# Altium schematic sheet D1.SchDoc
size D; SheetNumber: 0; SheetTotal: 0
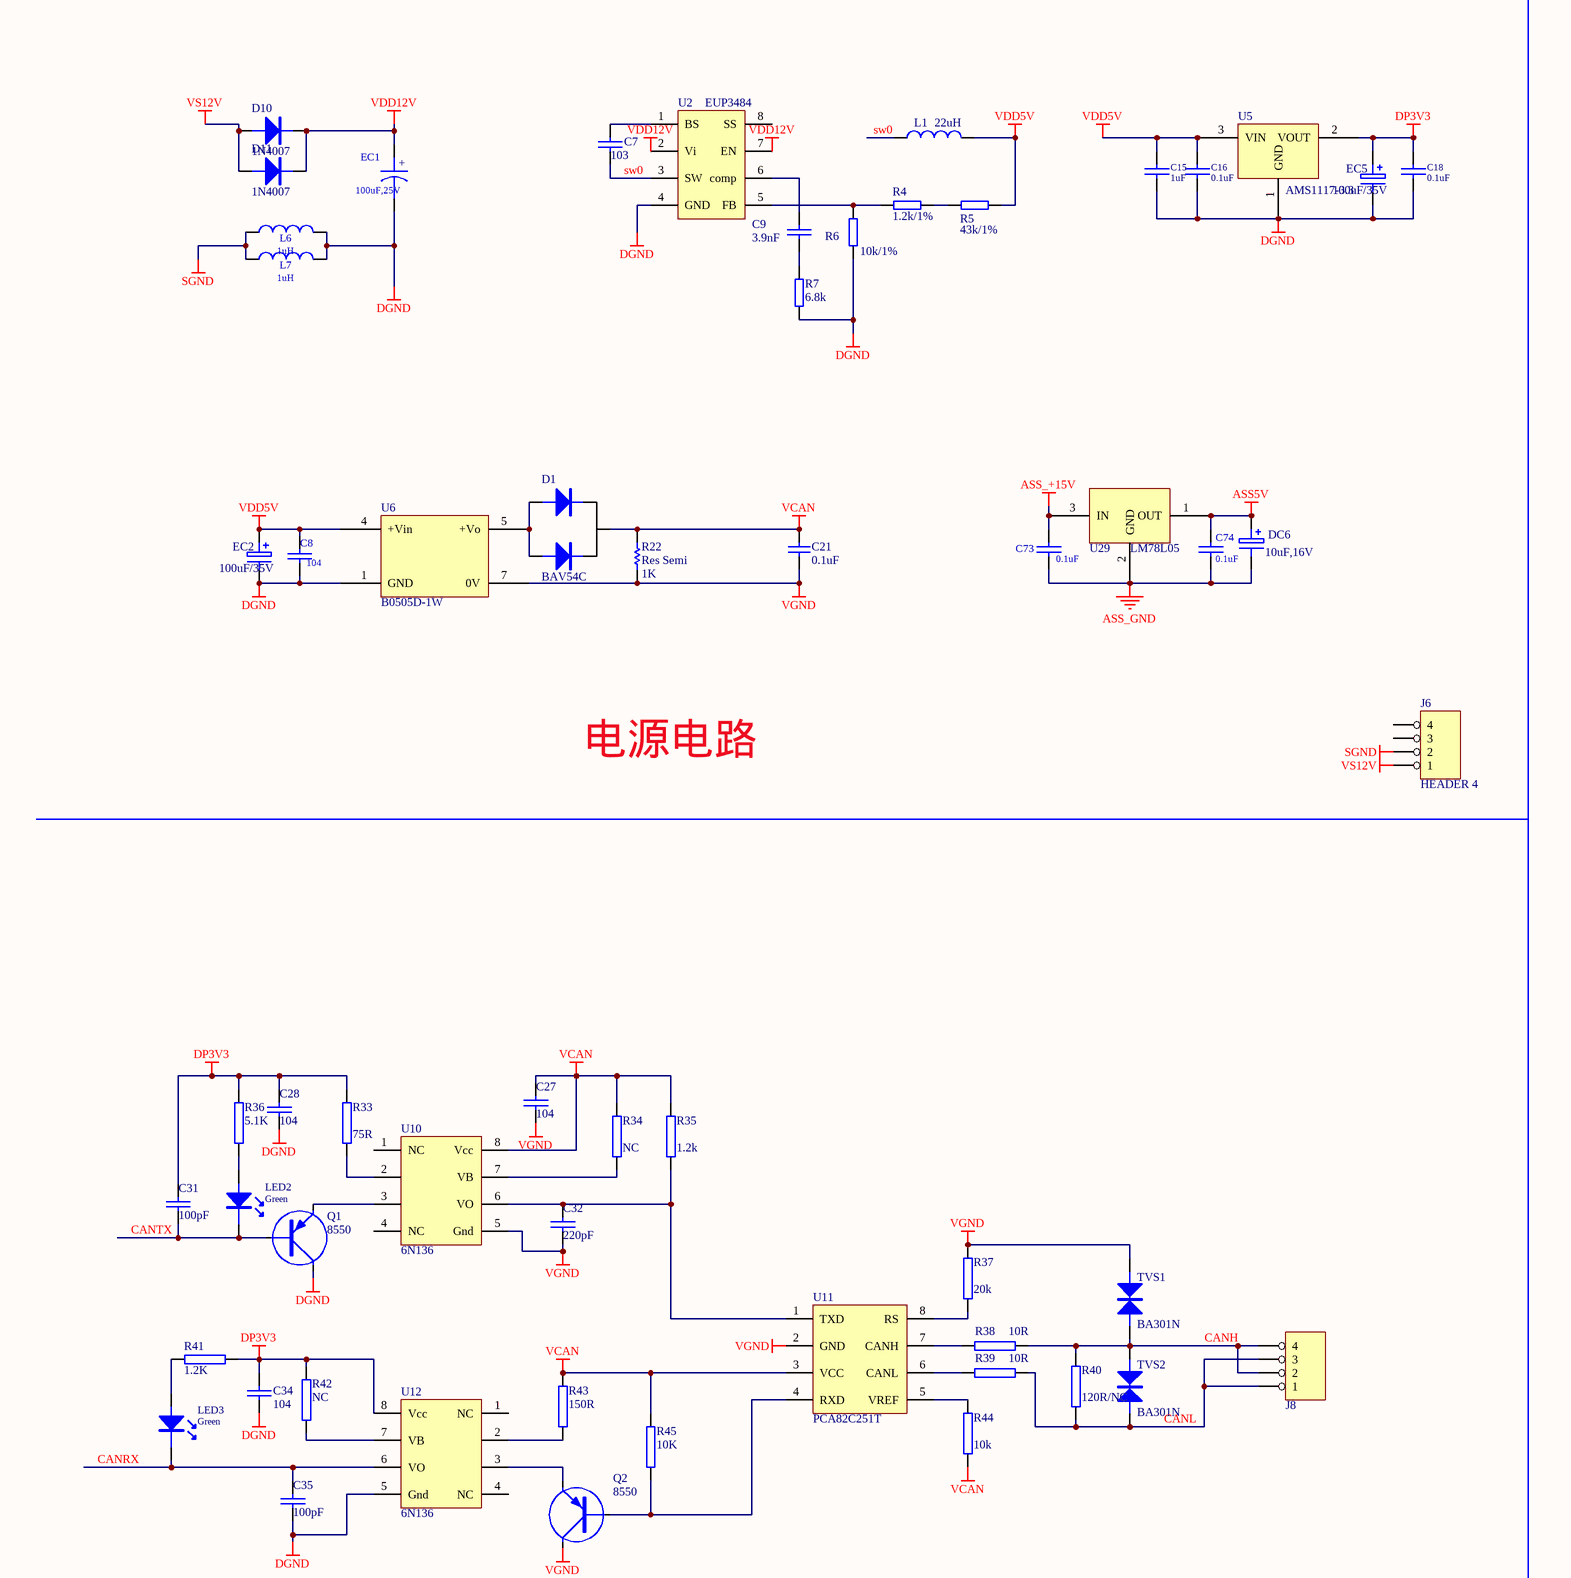
[diagram p0: D1.SchDoc, top left]
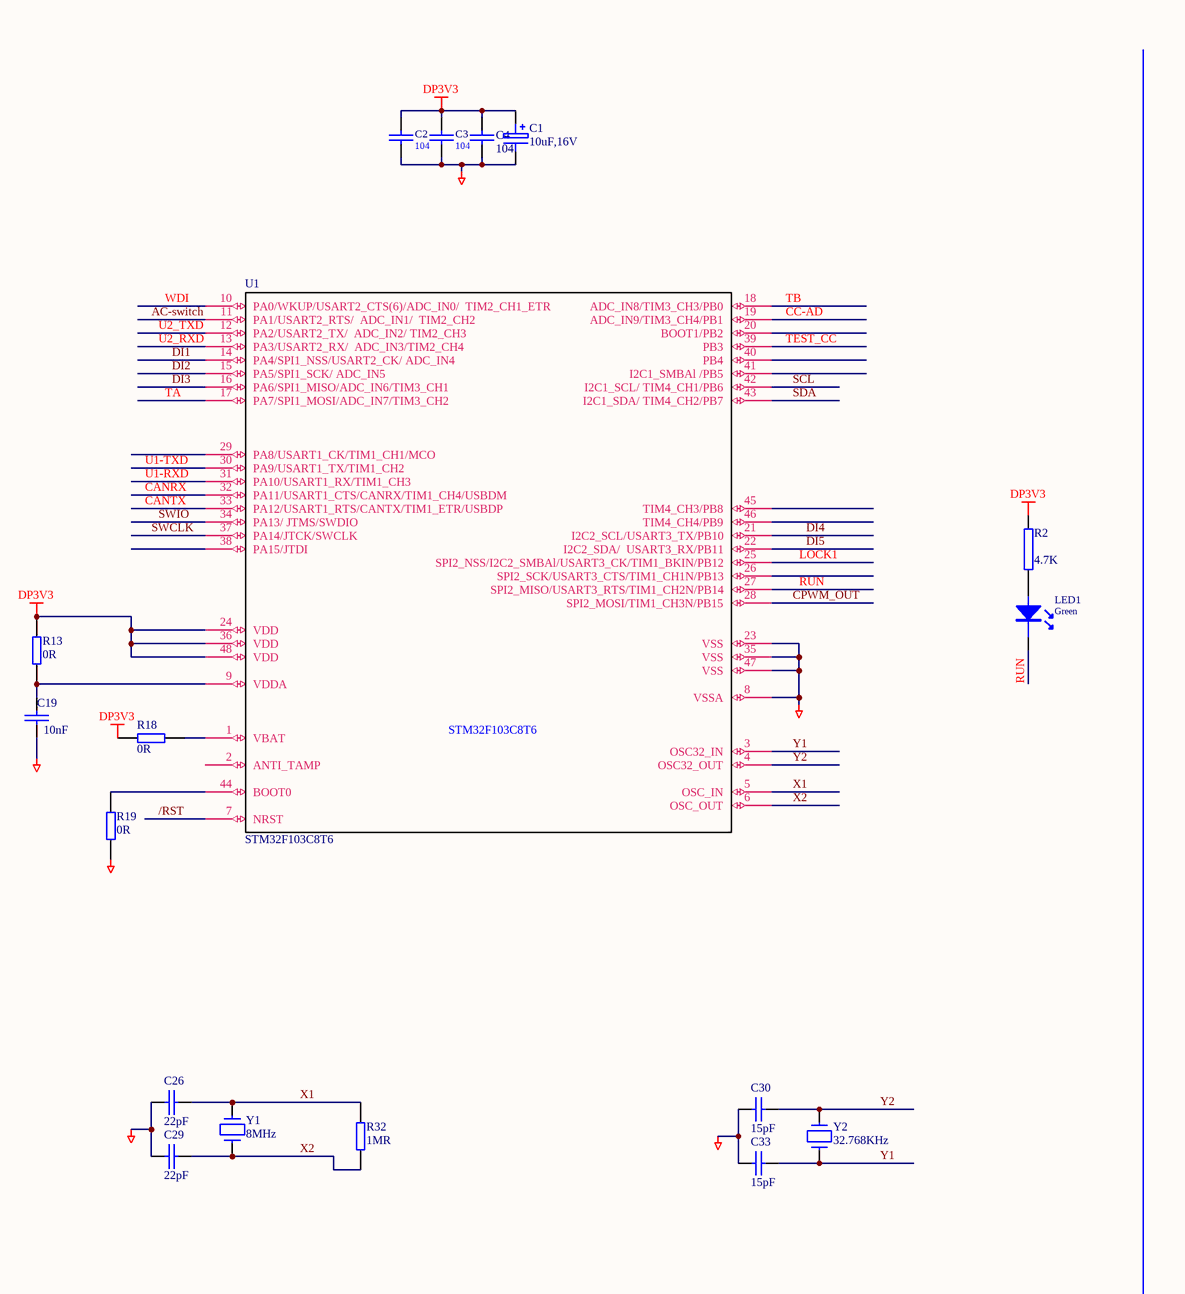
[diagram p1: D1.SchDoc, top middle]
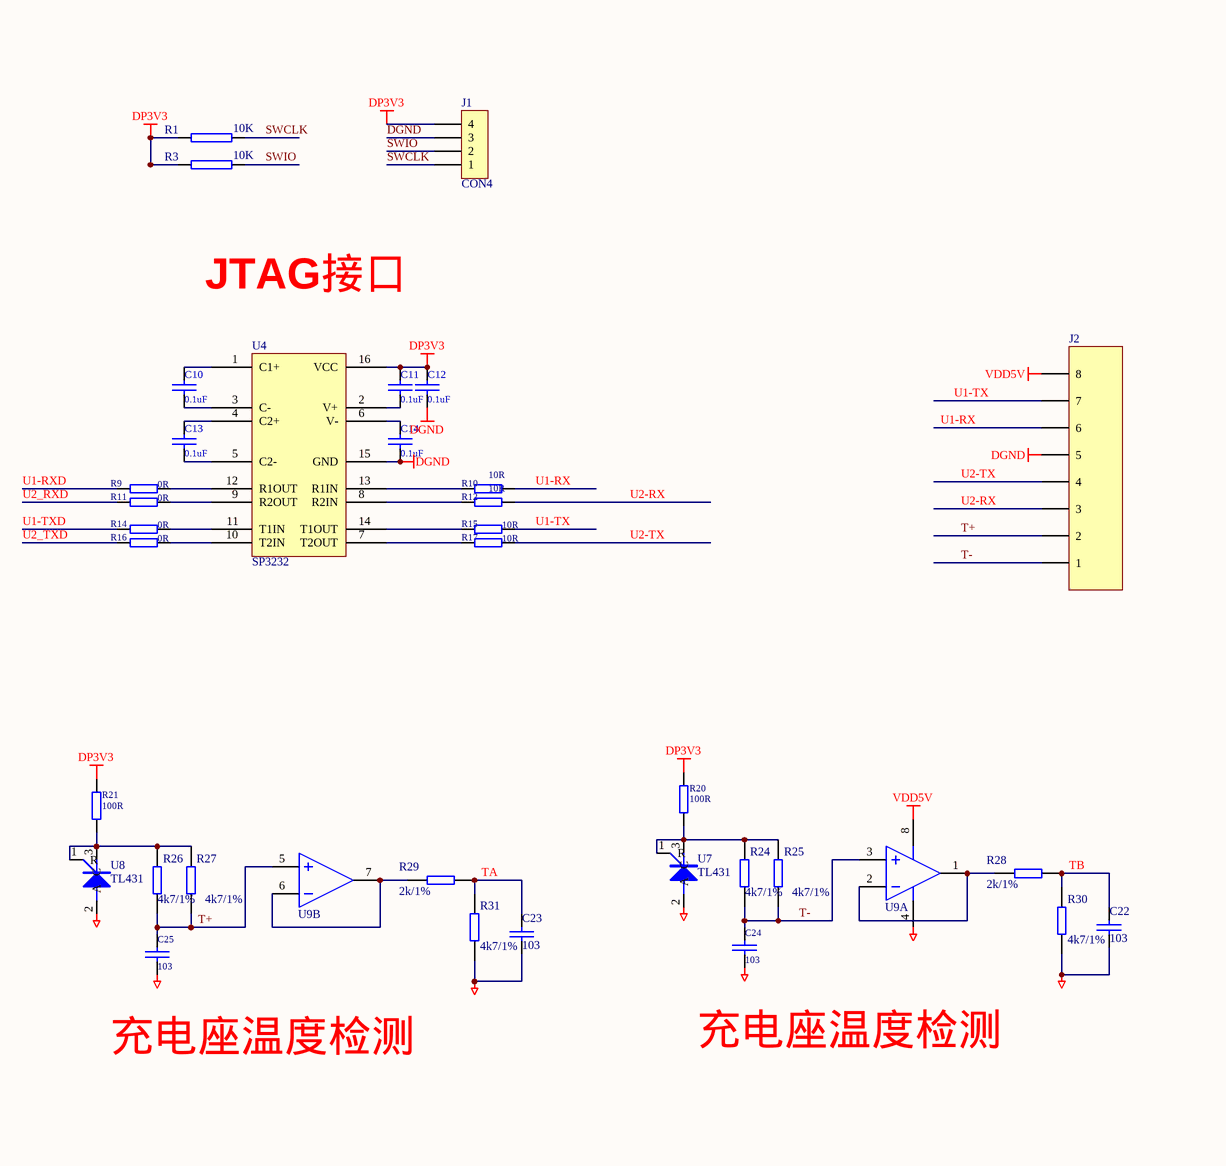
[diagram p2: D1.SchDoc, top right]
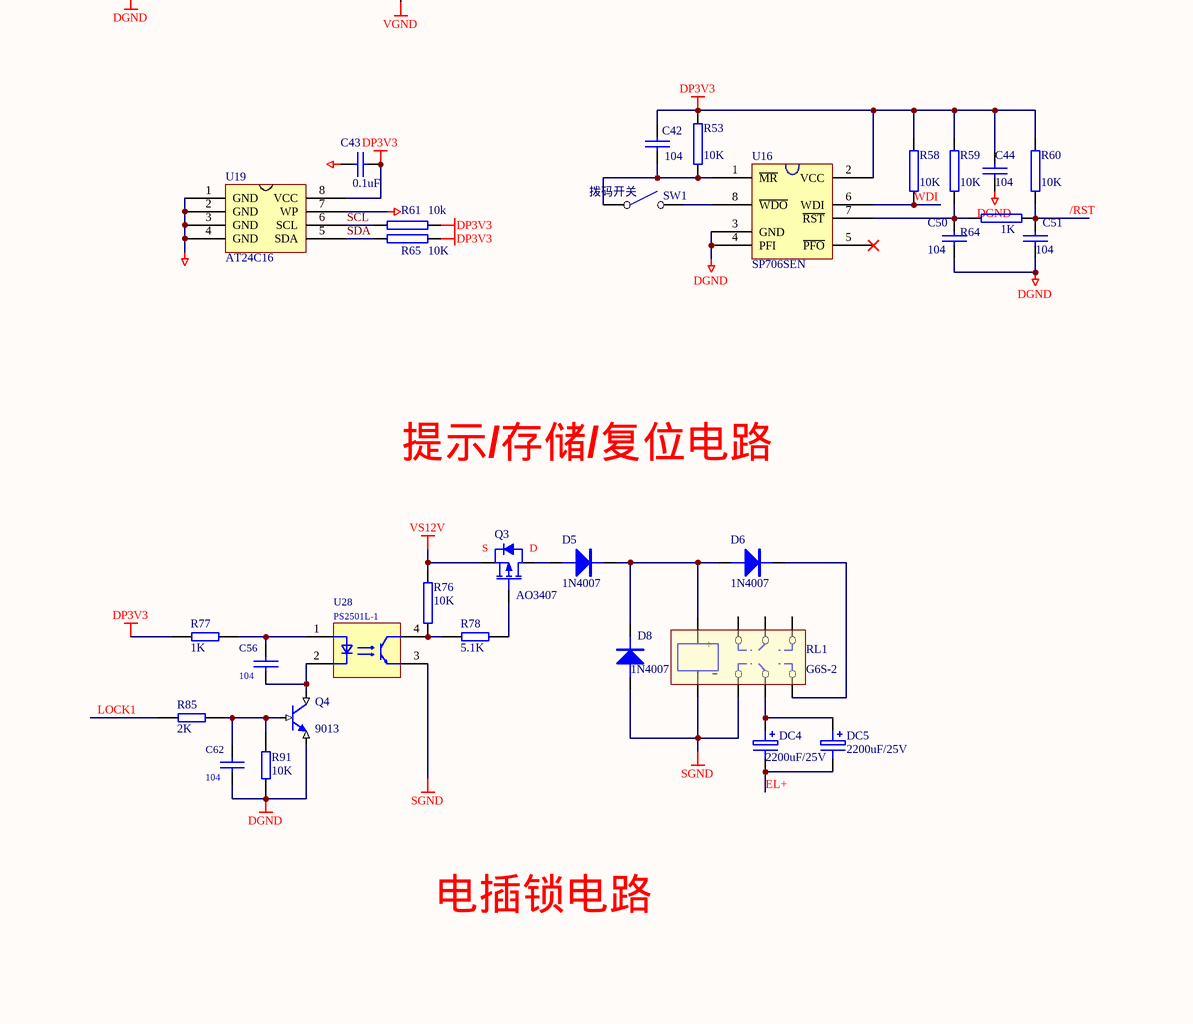
[diagram p3: D1.SchDoc, bottom left]
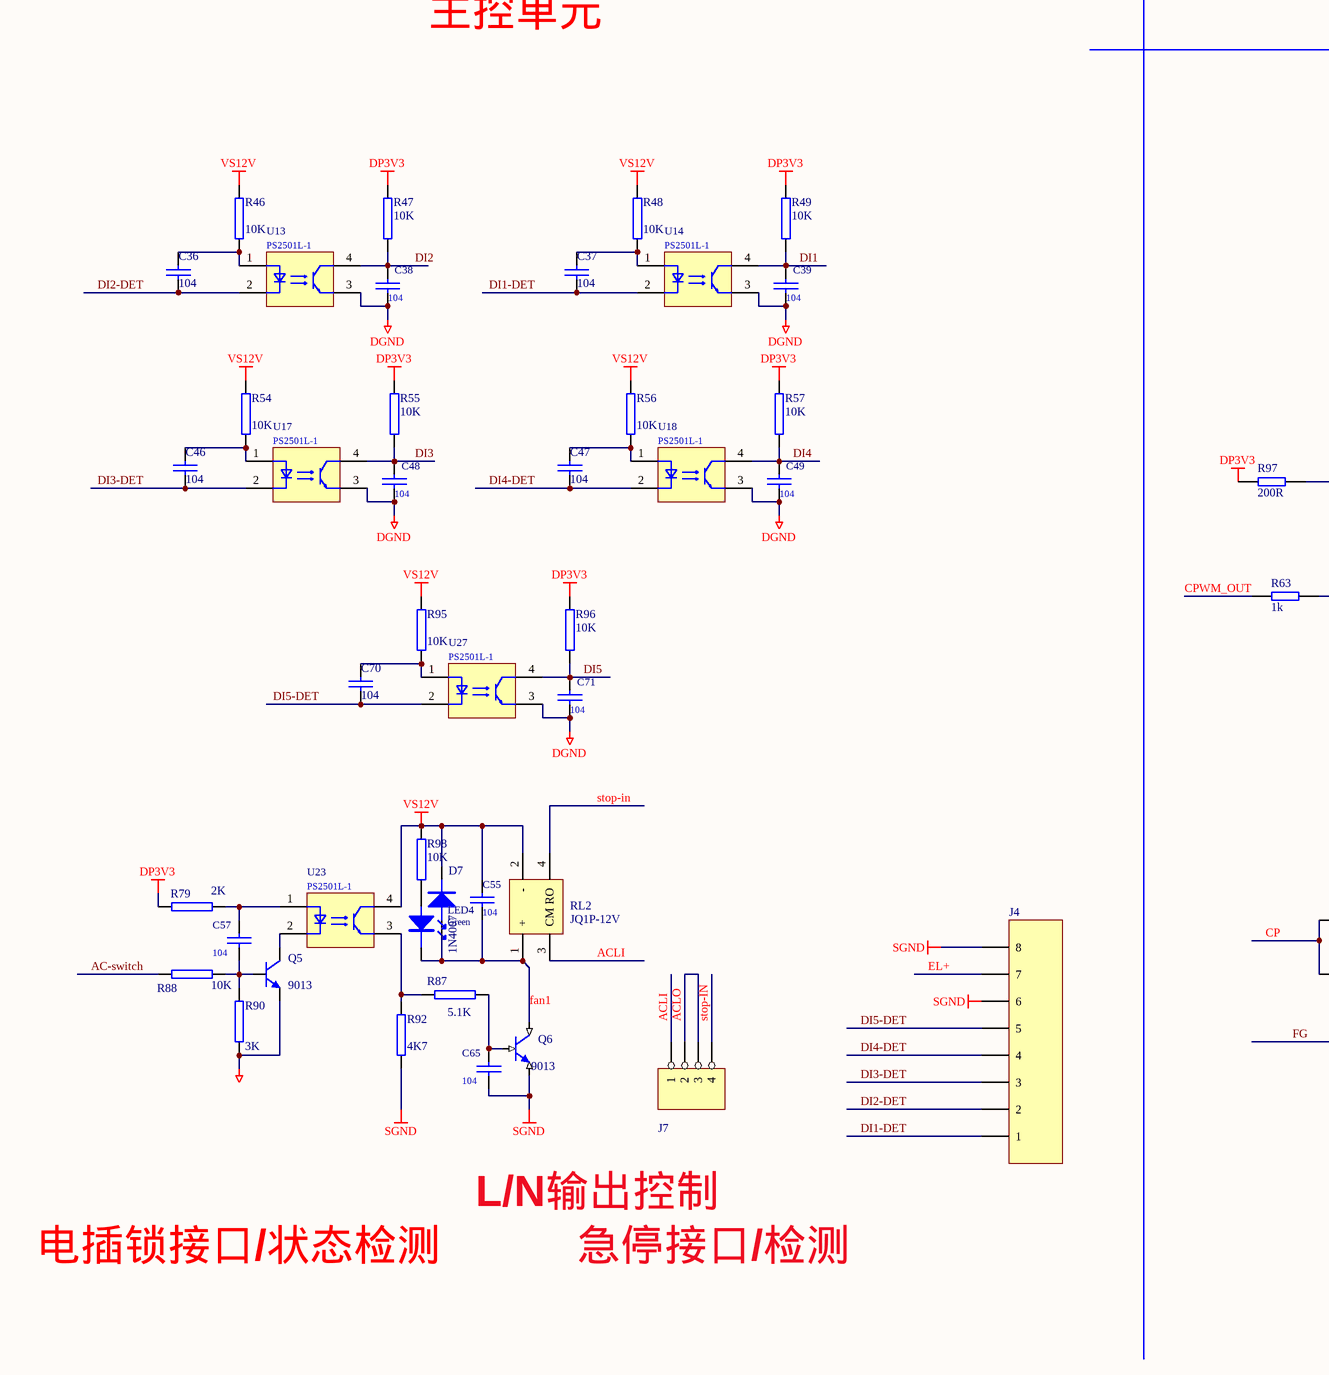
[diagram p4: D1.SchDoc, bottom middle]
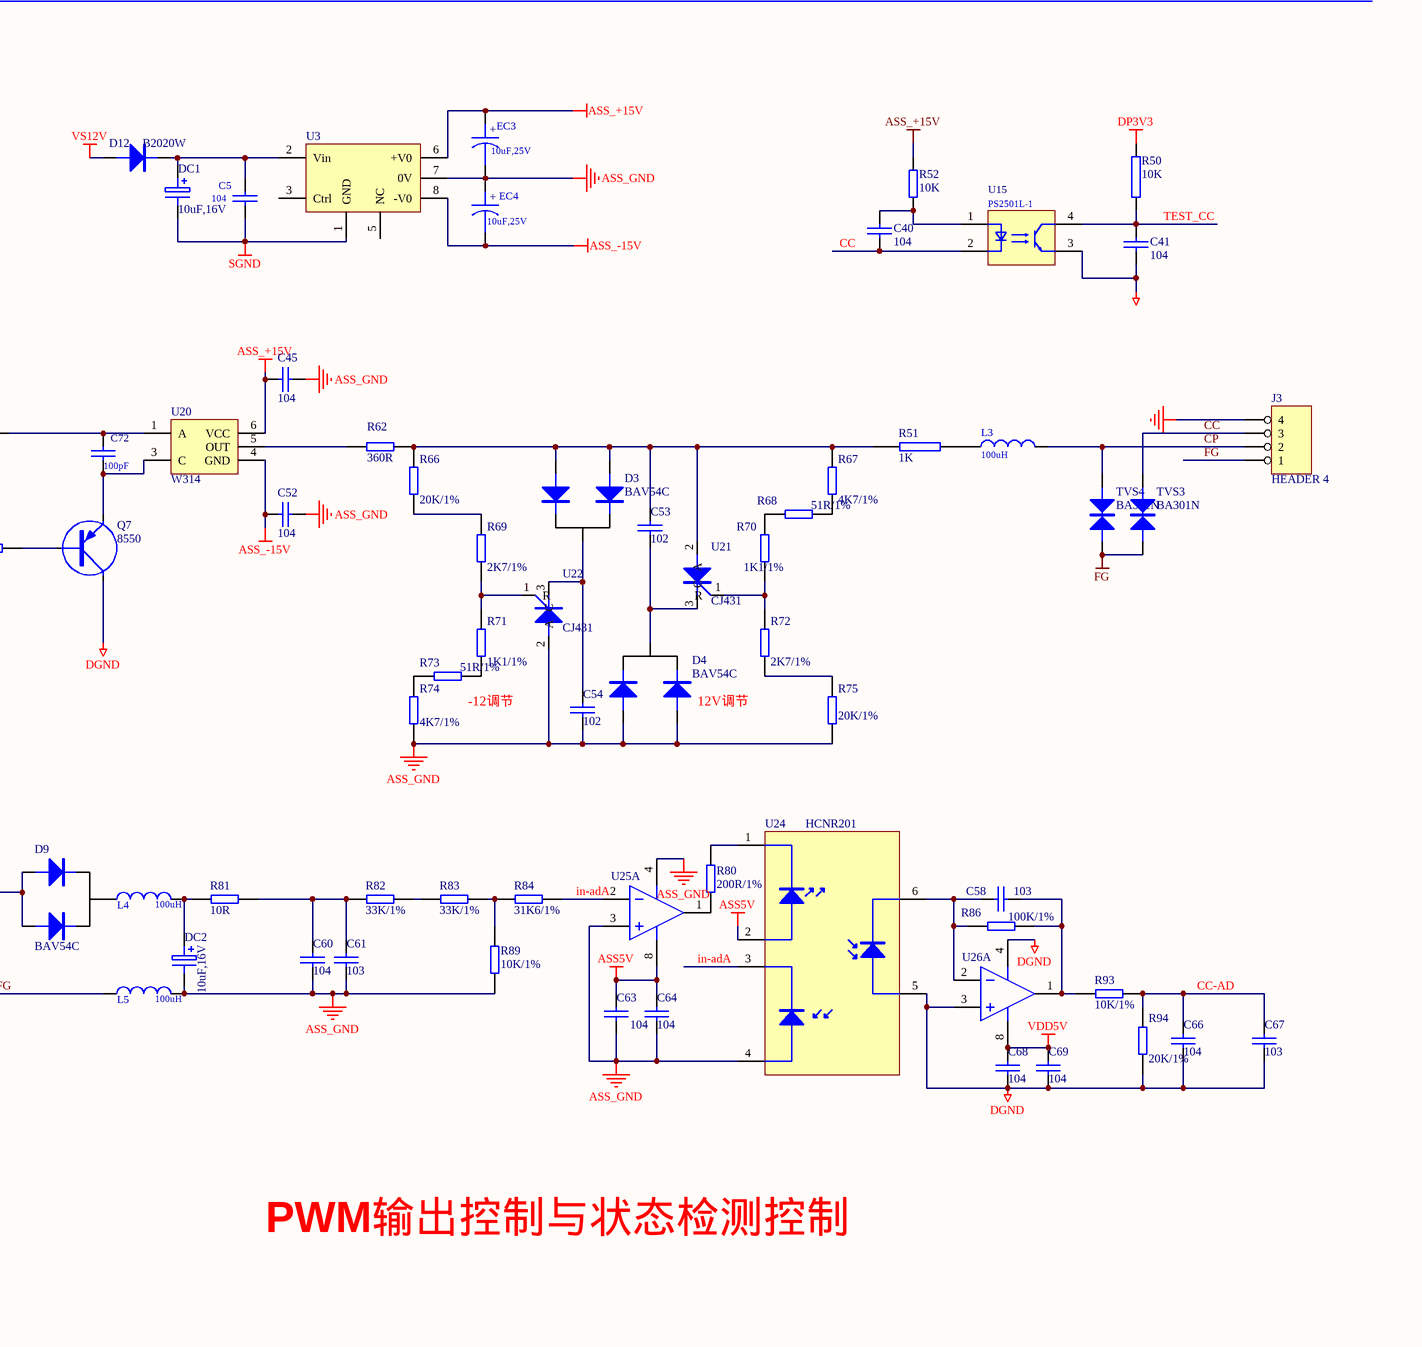
[diagram p5: D1.SchDoc, bottom right]

## Parts
C1  10uF,16V  [CA1206]
C2  104  [0603C]
C3  104  [0603C]
C4  104  [0603C]
C5  104  [0805C]
C7  103  [0603C]
C8  104  [0603C]
C9  3.9nF  [0603C]
C10  0.1uF  [0603C]
C11  0.1uF  [0603C]
C12  0.1uF  [0603C]
C13  0.1uF  [0603C]
C14  0.1uF  [0603C]
C15  1uF  [0805C]
C16  0.1uF  [0603C]
C18  0.1uF  [0603C]
C19  10nF  [0603C]
C21  0.1uF  [0603C]
C22  103  [0603C]
C23  103  [0603C]
C24  103  [0603C]
C25  103  [0603C]
C26  22pF  [0603C]
C27  104  [0603C]
C28  104  [0603C]
C29  22pF  [0603C]
C30  15pF  [0603C]
C31  100pF  [0603C]
C32  220pF  [0603C]
C33  15pF  [0603C]
C34  104  [0603C]
C35  100pF  [0603C]
C36  104  [0603C]
C37  104  [0603C]
C38  104  [0603C]
C39  104  [0603C]
C40  104  [0603C]
C41  104  [0603C]
C42  104  [0603C]
C43  0.1uF  [0603C]
C44  104  [0603C]
C45  104  [0603C]
C46  104  [0603C]
C47  104  [0603C]
C48  104  [0603C]
C49  104  [0603C]
C50  104  [0603C]
C51  104  [0603C]
C52  104  [0603C]
C53  102  [0603C]
C54  102  [0603C]
C55  104  [0603C]
C56  104  [0603C]
C57  104  [0603C]
C58  103  [0603C]
C60  104  [0603C]
C61  103  [0603C]
C62  104  [0603C]
C63  104  [0603C]
C64  104  [0603C]
C65  104  [0603C]
C66  104  [0603C]
C67  103  [0603C]
C68  104  [0603C]
C69  104  [0603C]
C70  104  [0603C]
C71  104  [0603C]
C72  100pF  [0603C]
C73  0.1uF  [0805C]
C74  0.1uF  [0805C]
D1  BAV54C  [SOT23]
D3  BAV54C  [SOT23]
D4  BAV54C  [SOT23]
D5  1N4007  [DO-214AC]
D6  1N4007  [DO-214AC]
D7  1N4007  [DO-214AC]
D8  1N4007  [DO-214AC]
D9  BAV54C  [SOT23]
D10  1N4007  [DO-214AC]
D11  1N4007  [DO-214AC]
D12  B2020W  [1206D]
DC1  10uF,16V  [CA1206]
DC2  10uF,16V  [CA1206]
DC4  2200uF/25V  [CAP12.5*20]
DC5  2200uF/25V  [CAP12.5*20]
DC6  10uF,16V  [CA1206]
EC1  100uF,25V  [C100UF16VEJ]
EC2  100uF/35V  [C100UF16VEJ]
EC3  10uF,25V  [CA1206]
EC4  10uF,25V  [CA1206]
EC5  100uF/35V  [C100UF16VEJ]
J1  CON4  [CON04_2.54]
J2  CON8  [KF2EDG-8P-3.81mm]  (value not drawn)
J3  HEADER 4  [KF2EDG-4P-3.81mm]
J4  CON8  [KF2EDG-8P-3.81mm]  (value not drawn)
J6  HEADER 4  [KF2EDG-4P-3.81mm]
J7  4 HEADER  [CON-5.08MM-4P]  (value not drawn)
J8  4 HEADER  [KF2EDG-4P-3.81mm]  (value not drawn)
L1  22uH  [LC7*7*3_L]
L3  100uH  [1206L]
L4  100uH  [1206L]
L5  100uH  [1206L]
L6  1uH  [1206L]
L7  1uH  [1206L]
LED1  Green  [D0805]
LED2  Green  [D0805]
LED3  Green  [D0805]
LED4  Green  [D0805]
Q1  8550  [SOT23]
Q2  8550  [SOT23]
Q3  AO3407  [SOT-23L]
Q4  9013  [SOT23]
Q5  9013  [SOT23]
Q6  9013  [SOT23]
Q7  8550  [SOT23]
R1  10K  [0603R]
R2  4.7K  [0603R]
R3  10K  [0603R]
R4  1.2k/1%  [0603R]
R5  43k/1%  [0603R]
R6  10k/1%  [0603R]
R7  6.8k  [0603R]
R9  0R  [0603R]
R10  10R  [0603R]
R11  0R  [0603R]
R12  10R  [0603R]
R13  0R  [0603R]
R14  0R  [0603R]
R15  10R  [0603R]
R16  0R  [0603R]
R17  10R  [0603R]
R18  0R  [0603R]
R19  0R  [0603R]
R20  100R  [0603R]
R21  100R  [0603R]
R22  Res Semi  value 1K  [0603R]
R24  4k7/1%  [0603R]
R25  4k7/1%  [0603R]
R26  4k7/1%  [0603R]
R27  4k7/1%  [0603R]
R28  2k/1%  [0603R]
R29  2k/1%  [0603R]
R30  4k7/1%  [0603R]
R31  4k7/1%  [0603R]
R32  1MR  [0603R]
R33  75R  [0603R]
R34  NC  [0603R]
R35  1.2k  [0603R]
R36  5.1K  [0603R]
R37  20k  [0603R]
R38  10R  [0805R]
R39  10R  [0805R]
R40  120R/NC  [1206R]
R41  1.2K  [0603R]
R42  NC  [0603R]
R43  150R  [0603R]
R44  10k  [0603R]
R45  10K  [0603R]
R46  10K  [0603R]
R47  10K  [0603R]
R48  10K  [0603R]
R49  10K  [0603R]
R50  10K  [0603R]
R51  1K  [1206R]
R52  10K  [0603R]
R53  10K  [0603R]
R54  10K  [0603R]
R55  10K  [0603R]
R56  10K  [0603R]
R57  10K  [0603R]
R58  10K  [0603R]
R59  10K  [0603R]
R60  10K  [0603R]
R61  10k  [0603R]
R62  360R  [1206R]
R63  1k  [0603R]
R64  1K  [0603R]
R65  10K  [0603R]
R66  20K/1%  [0603R]
R67  4K7/1%  [0603R]
R68  51R/1%  [0603R]
R69  2K7/1%  [0603R]
R70  1K1/1%  [0603R]
R71  1K1/1%  [0603R]
R72  2K7/1%  [0603R]
R73  51R/1%  [0603R]
R74  4K7/1%  [0603R]
R75  20K/1%  [0603R]
R76  10K  [0603R]
R77  1K  [0603R]
R78  5.1K  [0603R]
R79  2K  [0603R]
R80  200R/1%  [0603R]
R81  10R  [0603R]
R82  33K/1%  [0603R]
R83  33K/1%  [0603R]
R84  31K6/1%  [0603R]
R85  2K  [0603R]
R86  100K/1%  [0603R]
R87  5.1K  [0603R]
R88  10K  [0603R]
R89  10K/1%  [0603R]
R90  3K  [0603R]
R91  10K  [0603R]
R92  4K7  [0603R]
R93  10K/1%  [0603R]
R94  20K/1%  [0603R]
R95  10K  [0603R]
R96  10K  [0603R]
R97  200R  [0603R]
R98  10K  [0603R]
RL1  G6S-2  [G6S-2]
RL2  JQ1P-12V  [HF32F-12V]
SW1  拨码开关  [SW1]
TVS1  BA301N  [3528TVS]
TVS2  BA301N  [3528TVS]
TVS3  BA301N  [3528TVS]
TVS4  BA301N  [3528TVS]
U1  STM32F103C8T6  [LQFP48_N]
U2  EUP3484  [SOP8]
U3  WRA1215S-3WR2  [WRA1215S-3WR2]  (value not drawn)
U4  SP3232  [SO-16]
U5  AMS1117-3.3  [SOT223]
U6  B0505D-1W  [B0505S-1WR2]
U7  TL431  [SOT23]
U8  TL431  [SOT23]
U9  LM258  [SOP8]  (value not drawn)  (parts A,B of 2)
U10  6N136  [LC-SMD-8_6.3mm]
U11  PCA82C251T  [SOP8]
U12  6N136  [LC-SMD-8_6.3mm]
U13  PS2501L-1  [DIP-4]
U14  PS2501L-1  [DIP-4]
U15  PS2501L-1  [DIP-4]
U16  SP706SEN  [SOP8]
U17  PS2501L-1  [DIP-4]
U18  PS2501L-1  [DIP-4]
U19  AT24C16  [SOP8]
U20  W314  [w314 - duplicate]
U21  CJ431  [SOT23]
U22  CJ431  [SOT23]
U23  PS2501L-1  [DIP-4]
U24  HCNR201  [HCNR201 - S]
U25  LM258  [SOP8]  (value not drawn)  (part A of 2)
U26  LM258  [SOP8]  (value not drawn)  (part A of 2)
U27  PS2501L-1  [DIP-4]
U28  PS2501L-1  [DIP-4]
U29  LM78L05  [SOT-89]
Y1  8MHz  [ZS_SMD]
Y2  32.768KHz  [ZS-32.768]

## Nets
ASS5V: C63.2 C64.1 C74.2 DC6.1 U24.2 U25.8(VCC) U29.1(OUT)
ASS_+15V: C45.1 C73.2 EC3.1 R52.1 U3.6(+V0) U20.6(VCC) U29.3(IN)
ASS_-15V: C52.1 EC4.2 U3.8(-V0) U20.4(GND)
ASS_GND: C45.2 C52.2 C54.2 C60.2 C61.2 C63.1 C64.2 C73.1 C74.1 D4.1(A) D4.3(A) DC2.2 DC6.2 EC3.2 EC4.1 J3.4 L5.2 R74.1 R75.1 R89.1 U3.7(0V) U22.2(A) U24.4 U25.3(IN+) U25.4(GND) U29.2(GND)
DGND: C1.2 C2.1 C3.1 C4.1 C8.1 C12.1 C14.1 C15.2 C16.2 C18.2 C19.2 C22.1 C23.1 C24.1 C25.1 C26.1 C28.2 C29.1 C30.1 C33.1 C34.1 C35.2 C38.2 C39.2 C41.2 C43.2 C44.2 C48.2 C49.2 C50.1 C51.1 C62.2 C66.1 C67.1 C68.1 C69.1 C71.2 EC1.2 EC2.2 EC5.2 J1.3 J2.5 L6.2 L7.2 Q1.2(C) Q4.3(E) Q5.3(E) Q7.2(C) R6.2 R7.2 R19.1 R30.1 R31.1 R90.2 R91.1 R94.2 U1.8(VSSA) U1.23(VSS) U1.35(VSS) U1.47(VSS) U2.4(GND) U4.15(GND) U5.1(GND) U6.1(GND) U7.2(A) U8.2(A) U9.4(GND) U12.5(Gnd) U13.3 U14.3 U15.3 U16.3(GND) U16.4(PFI) U17.3 U18.3 U19.1(GND) U19.2(GND) U19.3(GND) U19.4(GND) U19.7(WP) U24.5 U26.3(IN+) U26.4(GND) U27.3
DP3V3: C1.1 C2.2 C3.2 C4.2 C11.2 C12.2 C18.1 C28.1 C31.1 C34.2 C42.1 C43.1 C44.1 EC5.1 J1.4 R1.2 R2.2 R3.2 R13.1 R18.2 R20.2 R21.2 R33.2 R36.2 R41.1 R42.1 R47.2 R49.2 R50.1 R53.2 R55.2 R57.2 R58.1 R59.1 R60.1 R61.1 R65.1 R77.1 R79.2 R96.2 R97.1 U1.24(VDD) U1.36(VDD) U1.48(VDD) U4.16(VCC) U5.2(VOUT) U12.8(Vcc) U16.2(VCC) U19.8(VCC)
FG: J3.1 L5.1 TVS3.1 TVS4.1
SGND: C5.1 C65.2 D8.1(A) DC1.2 J4.6 J4.8 J6.2 L6.1 L7.1 Q6.3(E) R92.2 RL1.3 RL1.12 U3.1(GND) U28.3
VCAN: C21.1 C27.1 D1.2(K) R22.2 R34.2 R35.2 R43.1 R44.1 R45.1 U10.8(Vcc) U11.3(VCC)
VDD5V: C8.2 C15.1 C16.1 C68.2 C69.2 EC2.1 J2.8 L1.2 R5.1 U5.3(VIN) U6.4(+Vin) U9.8(VCC) U26.8(VCC)
VDD12V: D10.2(K) D11.2(K) EC1.1 U2.2(Vi) U2.7(EN)
VGND: C21.2 C27.2 C32.2 Q2.2(C) R22.1 R37.2 TVS1.2 U6.7(0V) U10.5(Gnd) U11.2(GND)
VS12V: C55.1 D7.2(K) D10.1(A) D11.1(A) D12.1(A) J6.1 Q3.3(S) R46.2 R48.2 R54.2 R56.2 R76.2 R95.2 R98.1 RL2.2(-) U23.4
/RST: C51.2 R60.2 R64.2 U1.7(NRST)
AC-switch: R88.2 U1.11(PA1/USART2_RTS/__ADC_IN1/__TIM2_CH2)
ACLI: J7.1 RL2.3(CM)
ACLO: J7.2 J7.3
CANH: J8.2 J8.4 R38.2 R40.2 TVS1.1 TVS2.2
CANL: J8.1 J8.3 R39.2 R40.1 TVS2.1
CANRX: C35.1 LED3.2 U1.32(PA11/USART1_CTS/CANRX/TIM1_CH4/USBDM) U12.6(VO)
CANTX: C31.2 LED2.2 Q1.1(B) U1.33(PA12/USART1_RTS/CANTX/TIM1_ETR/USBDP)
CC: C40.2 J3.3 TVS3.2 U15.2
CC-AD: C66.2 C67.2 R93.2 R94.1 U1.19(ADC_IN9/TIM3_CH4/PB1)
CP: D9.1(A) D9.3(A) J3.2 L3.1 TVS4.2
CPWM_OUT: R63.1 U1.28(SPI2_MOSI/TIM1_CH3N/PB15)
DI1: C39.1 R49.1 U1.14(PA4/SPI1_NSS/USART2_CK/_ADC_IN4) U14.4
DI1-DET: C37.1 J4.1 U14.2
DI2: C38.1 R47.1 U1.15(PA5/SPI1_SCK/_ADC_IN5) U13.4
DI2-DET: C36.1 J4.2 U13.2
DI3: C48.1 R55.1 U1.16(PA6/SPI1_MISO/ADC_IN6/TIM3_CH1) U17.4
DI3-DET: C46.1 J4.3 U17.2
DI4: C49.1 R57.1 U1.21(I2C2_SCL/USART3_TX/PB10) U18.4
DI4-DET: C47.1 J4.4 U18.2
DI5: C71.1 R96.1 U1.22(I2C2_SDA/__USART3_RX/PB11) U27.4
DI5-DET: C70.1 J4.5 U27.2
EL+: DC4.2 DC5.2 J4.7
fan1: C55.2 D7.1(A) LED4.2 Q6.2(C) RL2.1(+)
in-adA: R84.2 U24.3 U25.2(IN-)
LOCK1: R85.1 U1.25(SPI2_NSS/I2C2_SMBAl/USART3_CK/TIM1_BKIN/PB12)
RUN: LED1.2 U1.27(SPI2_MISO/USART3_RTS/TIM1_CH2N/PB14)
SCL: R61.2 U1.42(I2C1_SCL/_TIM4_CH1/PB6) U19.6(SCL)
SDA: R65.2 U1.43(I2C1_SDA/_TIM4_CH2/PB7) U19.5(SDA)
stop-in: J7.4 RL2.4(RO)
sw0: C7.1 L1.1 U2.3(SW)
SWCLK: J1.1 R1.1 U1.37(PA14/JTCK/SWCLK)
SWIO: J1.2 R3.1 U1.34(PA13/_JTMS/SWDIO)
T+: C25.2 J2.2 R26.1 R27.1 U9.5(IN+)
T-: C24.2 J2.1 R24.1 R25.1 U9.3(IN+)
TA: C23.2 R29.1 R31.2 U1.17(PA7/SPI1_MOSI/ADC_IN7/TIM3_CH2)
TB: C22.2 R28.1 R30.2 U1.18(ADC_IN8/TIM3_CH3/PB0)
TEST_CC: C41.1 R50.2 U1.39(PB3) U15.4
U1-RX: J2.6 R10.2
U1-RXD: R9.1 U1.31(PA10/USART1_RX/TIM1_CH3)
U1-TX: J2.7 R15.2
U1-TXD: R14.1 U1.30(PA9/USART1_TX/TIM1_CH2)
U2-RX: J2.3 R12.2
U2-TX: J2.4 R17.2
U2_RXD: R11.1 U1.13(PA3/USART2_RX/__ADC_IN3/TIM2_CH4)
U2_TXD: R16.1 U1.12(PA2/USART2_TX/__ADC_IN2/_TIM2_CH3)
WDI: R58.2 U1.10(PA0/WKUP/USART2_CTS(6)/ADC_IN0/__TIM2_CH1_ETR) U16.6(WDI)
X1: C26.2 R32.1 U1.5(OSC_IN) Y1.2
X2: C29.2 R32.2 U1.6(OSC_OUT) Y1.1
Y1: C33.2 U1.3(OSC32_IN) Y2.1
Y2: C30.2 U1.4(OSC32_OUT) Y2.2
NetC5_2: C5.2 D12.2(K) DC1.1 U3.2(Vin)
NetC7_2: C7.2 U2.1(BS)
NetC9_1: C9.1 U2.6(comp)
NetC9_2: C9.2 R7.1
NetC10_1: C10.1 U4.3(C-)
NetC10_2: C10.2 U4.1(C1+)
NetC11_1: C11.1 U4.2(V+)
NetC13_1: C13.1 U4.5(C2-)
NetC13_2: C13.2 U4.4(C2+)
NetC14_2: C14.2 U4.6(V-)
NetC19_1: C19.1 R13.2 U1.9(VDDA)
NetC32_1: C32.1 R35.1 U10.6(VO) U11.1(TXD)
NetC36_2: C36.2 R46.1 U13.1
NetC37_2: C37.2 R48.1 U14.1
NetC40_1: C40.1 R52.2 U15.1
NetC42_2: C42.2 R53.1 SW1.1(COMMON) U16.1(~{MR})
NetC46_2: C46.2 R54.1 U17.1
NetC47_2: C47.2 R56.1 U18.1
NetC50_2: C50.2 R59.2 R64.1 U16.7(~{RST})
NetC53_1: C53.1 D4.2(K) U21.3(C)
NetC53_2: C53.2 D3.1(A) D3.3(A) R51.1 R62.1 R66.2 R67.2 U21.2(A)
NetC54_1: C54.1 D3.2(K) U22.3(C)
NetC56_1: C56.1 R77.2 U28.1
NetC56_2: C56.2 Q4.2(C) U28.2
NetC57_1: C57.1 R79.1 U23.1
NetC57_2: C57.2 Q5.1(B) R88.1 R90.1
NetC58_1: C58.1 R86.1 R93.1 U26.1(OUT)
NetC58_2: C58.2 R86.2 U24.6 U26.2(IN-)
NetC60_1: C60.1 C61.1 R81.2 R82.1
NetC62_1: C62.1 Q4.1(B) R85.2 R91.2
NetC65_1: C65.1 Q6.1(B) R87.2
NetC70_2: C70.2 R95.1 U27.1
NetC72_1: C72.1 R97.2 U20.1(A)
NetC72_2: C72.2 Q7.3(E) U20.3(C)
NetD1_1: D1.1(A) D1.3(A) U6.5(+Vo)
NetD5_1: D5.1(A) Q3.2(D)
NetD5_2: D5.2(K) D6.1(A) D8.2(K) RL1.1
NetD6_2: D6.2(K) RL1.5
NetD9_2: D9.2(K) L4.1
NetDC2_1: DC2.1 L4.2 R81.1
NetDC4_1: DC4.1 DC5.1 RL1.4
NetL3_2: L3.2 R51.2
NetLED1_1: LED1.1 R2.1
NetLED2_1: LED2.1 R36.1
NetLED3_1: LED3.1 R41.2
NetLED4_1: LED4.1 R98.2
NetQ1_3: Q1.3(E) U10.3
NetQ2_1: Q2.1(B) R45.2 U11.4(RXD)
NetQ2_3: Q2.3(E) U12.3
NetQ3_1: Q3.1(G) R78.2
NetQ5_2: Q5.2(C) U23.2
NetQ7_1: Q7.1(B) R63.2
NetR4_1: R4.1 R5.2
NetR4_2: R4.2 R6.1 U2.5(FB)
NetR9_2: R9.2 U4.12(R1OUT)
NetR10_1: R10.1 U4.13(R1IN)
NetR11_2: R11.2 U4.9(R2OUT)
NetR12_1: R12.1 U4.8(R2IN)
NetR14_2: R14.2 U4.11(T1IN)
NetR15_1: R15.1 U4.14(T1OUT)
NetR16_2: R16.2 U4.10(T2IN)
NetR17_1: R17.1 U4.7(T2OUT)
NetR18_1: R18.1 U1.1(VBAT)
NetR19_2: R19.2 U1.44(BOOT0)
NetR20_1: R20.1 R24.2 R25.2 U7.1(R) U7.3(C)
NetR21_1: R21.1 R26.2 R27.2 U8.1(R) U8.3(C)
NetR28_2: R28.2 U9.1(OUT) U9.2(IN-)
NetR29_2: R29.2 U9.6(IN-) U9.7(OUT)
NetR33_1: R33.1 U10.2
NetR34_1: R34.1 U10.7(VB)
NetR37_1: R37.1 U11.8(RS)
NetR38_1: R38.1 U11.7(CANH)
NetR39_1: R39.1 U11.6(CANL)
NetR42_2: R42.2 U12.7(VB)
NetR43_2: R43.2 U12.2
NetR44_2: R44.2 U11.5(VREF)
NetR62_2: R62.2 U20.5(OUT)
NetR66_1: R66.1 R69.2
NetR67_1: R67.1 R68.2
NetR68_1: R68.1 R70.2
NetR69_1: R69.1 R71.2 U22.1(R)
NetR70_1: R70.1 R72.2 U21.1(R)
NetR71_1: R71.1 R73.2
NetR72_1: R72.1 R75.2
NetR73_1: R73.1 R74.2
NetR76_1: R76.1 R78.1 U28.4
NetR80_1: R80.1 U25.1(OUT)
NetR80_2: R80.2 U24.1
NetR82_2: R82.2 R83.1
NetR83_2: R83.2 R84.1 R89.2
NetR87_1: R87.1 R92.1 U23.3
NetSW1_2: SW1.2(NO) U16.8(~{WDO})

Not connected (* = marked no-connect by the designer): J6 3 4; RL1 8 9 10; U1 2(ANTI_TAMP) 20(BOOT1/PB2) 26(SPI2_SCK/USART3_CTS/TIM1_CH1N/PB13) 29(PA8/USART1_CK/TIM1_CH1/MCO) 38(PA15/JTDI) 40(PB4) 41(I2C1_SMBAl_/PB5) 45(TIM4_CH3/PB8) 46(TIM4_CH4/PB9); U2 8(SS); U3 3(Ctrl) 5(NC); U10 1(NC) 4(NC); U12 1(NC) 4(NC); U16 5(~{PFO})*

## Notes on the sheet
- JTAG接口
- 电源电路
- (near C25) 充电座温度检测
- (near C24) 充电座温度检测
- 主控单元
- 提示/存储/复位电路
- (near R73) -12调节
- (near D4) 12V调节
- (near Q3) S
- (near Q3) D
- 电插锁电路
- L/N输出控制
- 电插锁接口/状态检测
- 急停接口/检测
- PWM输出控制与状态检测控制
- (in symbol CAPACITOR POL) +
- (in symbol G6S-2) +; -

## Library data of the parts
C1 DC2 = CAP2: 贴片钽电容/16V/10uF/A型3216/AVX
C2 C3 C38 C39 C48 C49 C71 C72 = CAP: 0603贴片电容/50V/0.1uF/±10%/X7R
C4 C19 C27-C29 C31-C37 C42-C47 C50-C54 C60 C63 C64 C66 C68-C70 = CAP1: 0603贴片电容/50V/0.1uF/±10%/X7R
C5 C8 C10-C16 C18 C24 C25 C40 C41 C55-C57 C62 C65 C73 C74 = CAP: Capacitor
C7 C9 = CAP
C21 = Cap Semi: Capacitor (Semiconductor SIM Model); Value: 105/25V; Published: 8-Jun-2000; LatestRevisionDate: 17-Jul-2002; LatestRevisionNote: Re-released for DXP Platform.; PackageReference: C1206; Publisher: Altium Limited
C22 C23 = CAP1: Capacitor
C26 C30 = CAP1: 0603贴片电容/50V/1uF/±10%/X7R
C58 C61 C67 = CAP1: 0603贴片电容/50V/10nF/±10%/X7R
D5-D8 D10-D12 = DIODE
DC1 DC4-DC6 EC2 EC5 = CAP2
EC1 = CAPACITOR POL: 贴片铝电解电容/16V/100uF/6.3*5.4
EC3 EC4 = CAPACITOR POL: Capacitor
J1 = CON4: Connector
J3 J6-J8 = 4 HEADER: 4 Pin Header
L1 L3 L6 L7 = INDUCTOR
L4 L5 = INDUCTOR: 贴片功率电感/100uH/LC7*7*3
LED1-LED4 = LED: 17-21/GHC-XS1T2M/3T,绿色LED/0805/亿光
Q1 Q2 Q7 = PNP: PNP Transistor
Q3 = PMOS
Q4-Q6 = NPN
R1 R3 R13 R18 R19 R24-R45 R50 R76-R79 R85 R87 R88 R90-R92 R98 = RES1
R2 R63 R97 = RES1: 0603贴片电阻/200R/0.1W/±5%
R4-R7 = R_S
R9-R12 R14-R17 R20 R21 R52 = RES-1: RES
R22 = Res Semi: Semiconductor Resistor; Published: 8-Jun-2000; LatestRevisionDate: 17-Jul-2002; LatestRevisionNote: Re-released for DXP Platform.; PackageReference: AXIAL-0.5; Publisher: Altium Limited
R46 R48 R54 R56 R95 = RES1: 0603贴片电阻/2K/0.1W/±5%
R47 R49 R53 R55 R57-R61 R65 R96 = RES1: 0603贴片电阻/10K/0.1W/±5%
R51 = RES2: 五色环/轴状/金属膜电阻/1K/1W/±1%
R62 = RES1: 0603贴片电阻/10R/0.1W/±5%
R64 = RES1: 0603贴片电阻/47R/0.1W/±5%
R66 R75 = RES1: 0603贴片电阻/20K/0.1W/±1%
R67 R74 = RES1: 0603贴片电阻/4.7K/0.1W/±1%
R68 R73 = RES1: 0603贴片电阻/51R/0.1W/±1%
R69 R72 = RES1: 0603贴片电阻/2.7K/0.1W/±1%
R70 R71 = RES1: 0603贴片电阻/1.1K/0.1W/±1%
R80 = RES1: 0603贴片电阻/200R/0.1W/±1%
R81-R83 R89 = RES1: 0603贴片电阻/33K/0.1W/±1%
R84 R86 = RES1: 0603贴片电阻/31.6K/0.1W/±1%
R93 R94 = RES1: 0603贴片电阻/10K/0.1W/±1%
SW1 = SW SPST: 直插拔码开关1位/DIP2/蓝色/脚距8mm
TVS1-TVS4 = TVS
U4 = MAX232ESE
U5 = AMS1117
U6 = BXXXXD-1W
U9 = AS358P-E1
U13 U14 U17 U18 U27 = PS2501-1: PS2501L-1,SOP4,CEL
U15 U23 U28 = PS2501-1
U16 = SP706SEN: SP706SEN,SOP8,Sipex
U19 = AT24C64: EEPROM/64K/2.7V/SOP8/ATMEL
U20 = TLP113: TLP114A,5_PIN,TOSHIBA
U21 U22 = TL431: TL431,SOT23/ST/ON
U24 = HCNR200: HCNR201,DIP8,HP
U25 U26 = AS358P-E1: LM258,SOIC8,TI
U29 = LM7805
Y1 Y2 = CRYSTAL: 32.768KHz晶振/圆柱形/2*6mm